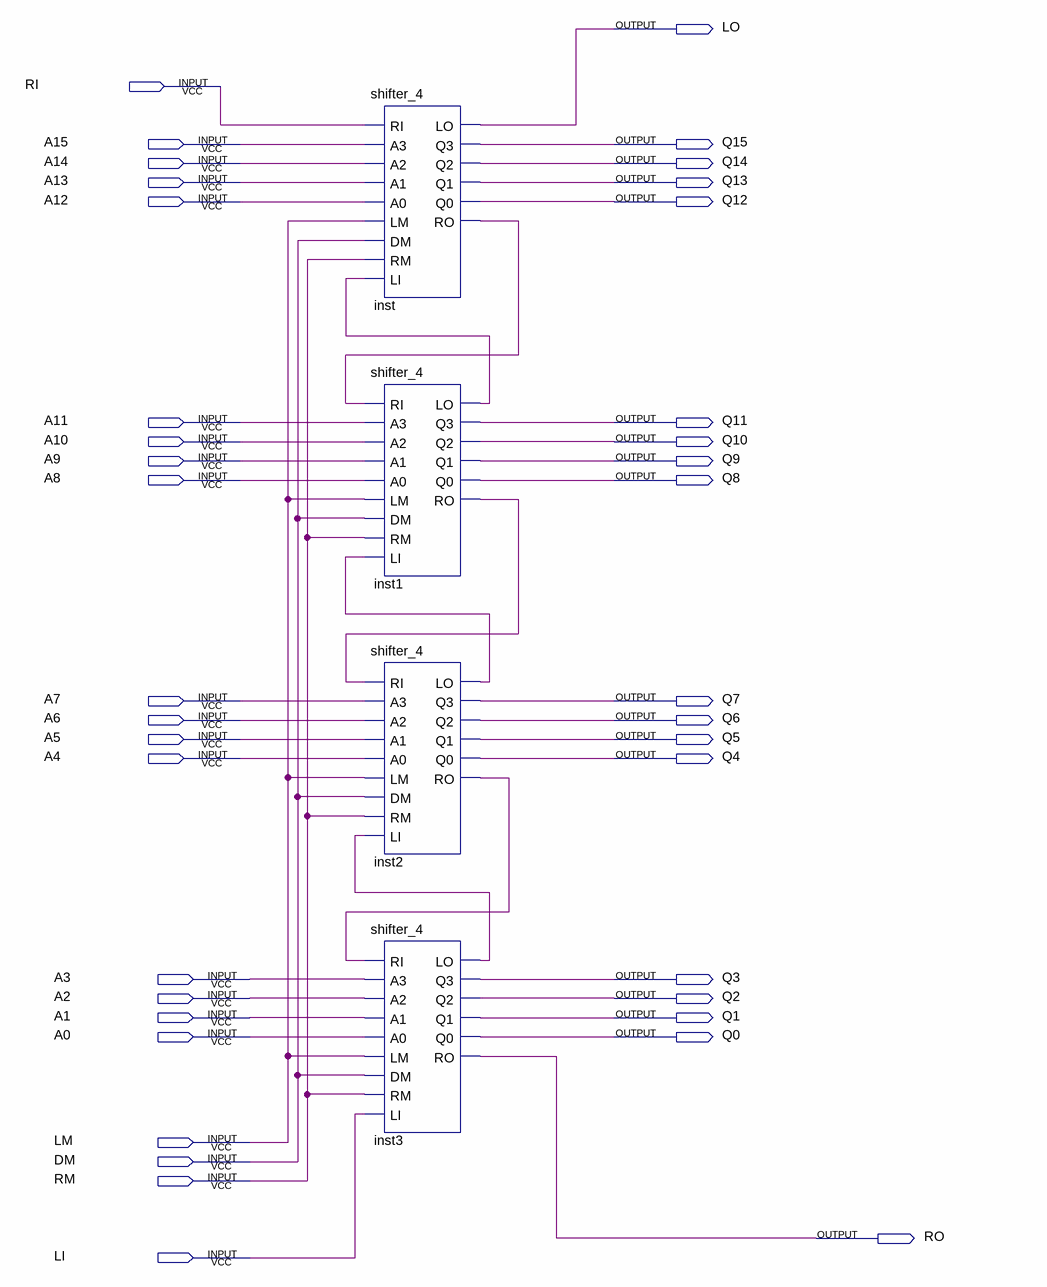
[diagram p0: schematic sheet]
// Quartus schematic shifter_16.bdf as structural Verilog: 4 symbols, 39 pins
module shifter_16 (
  input  RI,
  input  A15,
  input  A14,
  input  A13,
  input  A12,
  input  A11,
  input  A10,
  input  A9,
  input  A8,
  input  A7,
  input  A6,
  input  A5,
  input  A4,
  input  A3,
  input  A2,
  input  A1,
  input  A0,
  input  LM,
  input  DM,
  input  RM,
  input  LI,
  output LO,
  output Q15,
  output Q14,
  output Q13,
  output Q12,
  output Q11,
  output Q10,
  output Q9,
  output Q8,
  output Q7,
  output Q6,
  output Q5,
  output Q4,
  output Q3,
  output Q2,
  output Q1,
  output Q0,
  output RO
);

  wire inst1_lo, inst1_ro, inst2_lo, inst2_ro, inst3_lo, inst_ro;

  shifter_4 inst (
    .RI(RI), .A3(A15), .A2(A14), .A1(A13), .A0(A12), .LM(LM), .DM(DM), .RM(RM), .LI(inst1_lo), .LO(LO),
    .Q3(Q15), .Q2(Q14), .Q1(Q13), .Q0(Q12), .RO(inst_ro));
  shifter_4 inst1 (
    .RI(inst_ro), .A3(A11), .A2(A10), .A1(A9), .A0(A8), .LM(LM), .DM(DM), .RM(RM), .LI(inst2_lo),
    .LO(inst1_lo), .Q3(Q11), .Q2(Q10), .Q1(Q9), .Q0(Q8), .RO(inst1_ro));
  shifter_4 inst2 (
    .RI(inst1_ro), .A3(A7), .A2(A6), .A1(A5), .A0(A4), .LM(LM), .DM(DM), .RM(RM), .LI(inst3_lo),
    .LO(inst2_lo), .Q3(Q7), .Q2(Q6), .Q1(Q5), .Q0(Q4), .RO(inst2_ro));
  shifter_4 inst3 (
    .RI(inst2_ro), .A3(A3), .A2(A2), .A1(A1), .A0(A0), .LM(LM), .DM(DM), .RM(RM), .LI(LI), .LO(inst3_lo),
    .Q3(Q3), .Q2(Q2), .Q1(Q1), .Q0(Q0), .RO(RO));
endmodule
